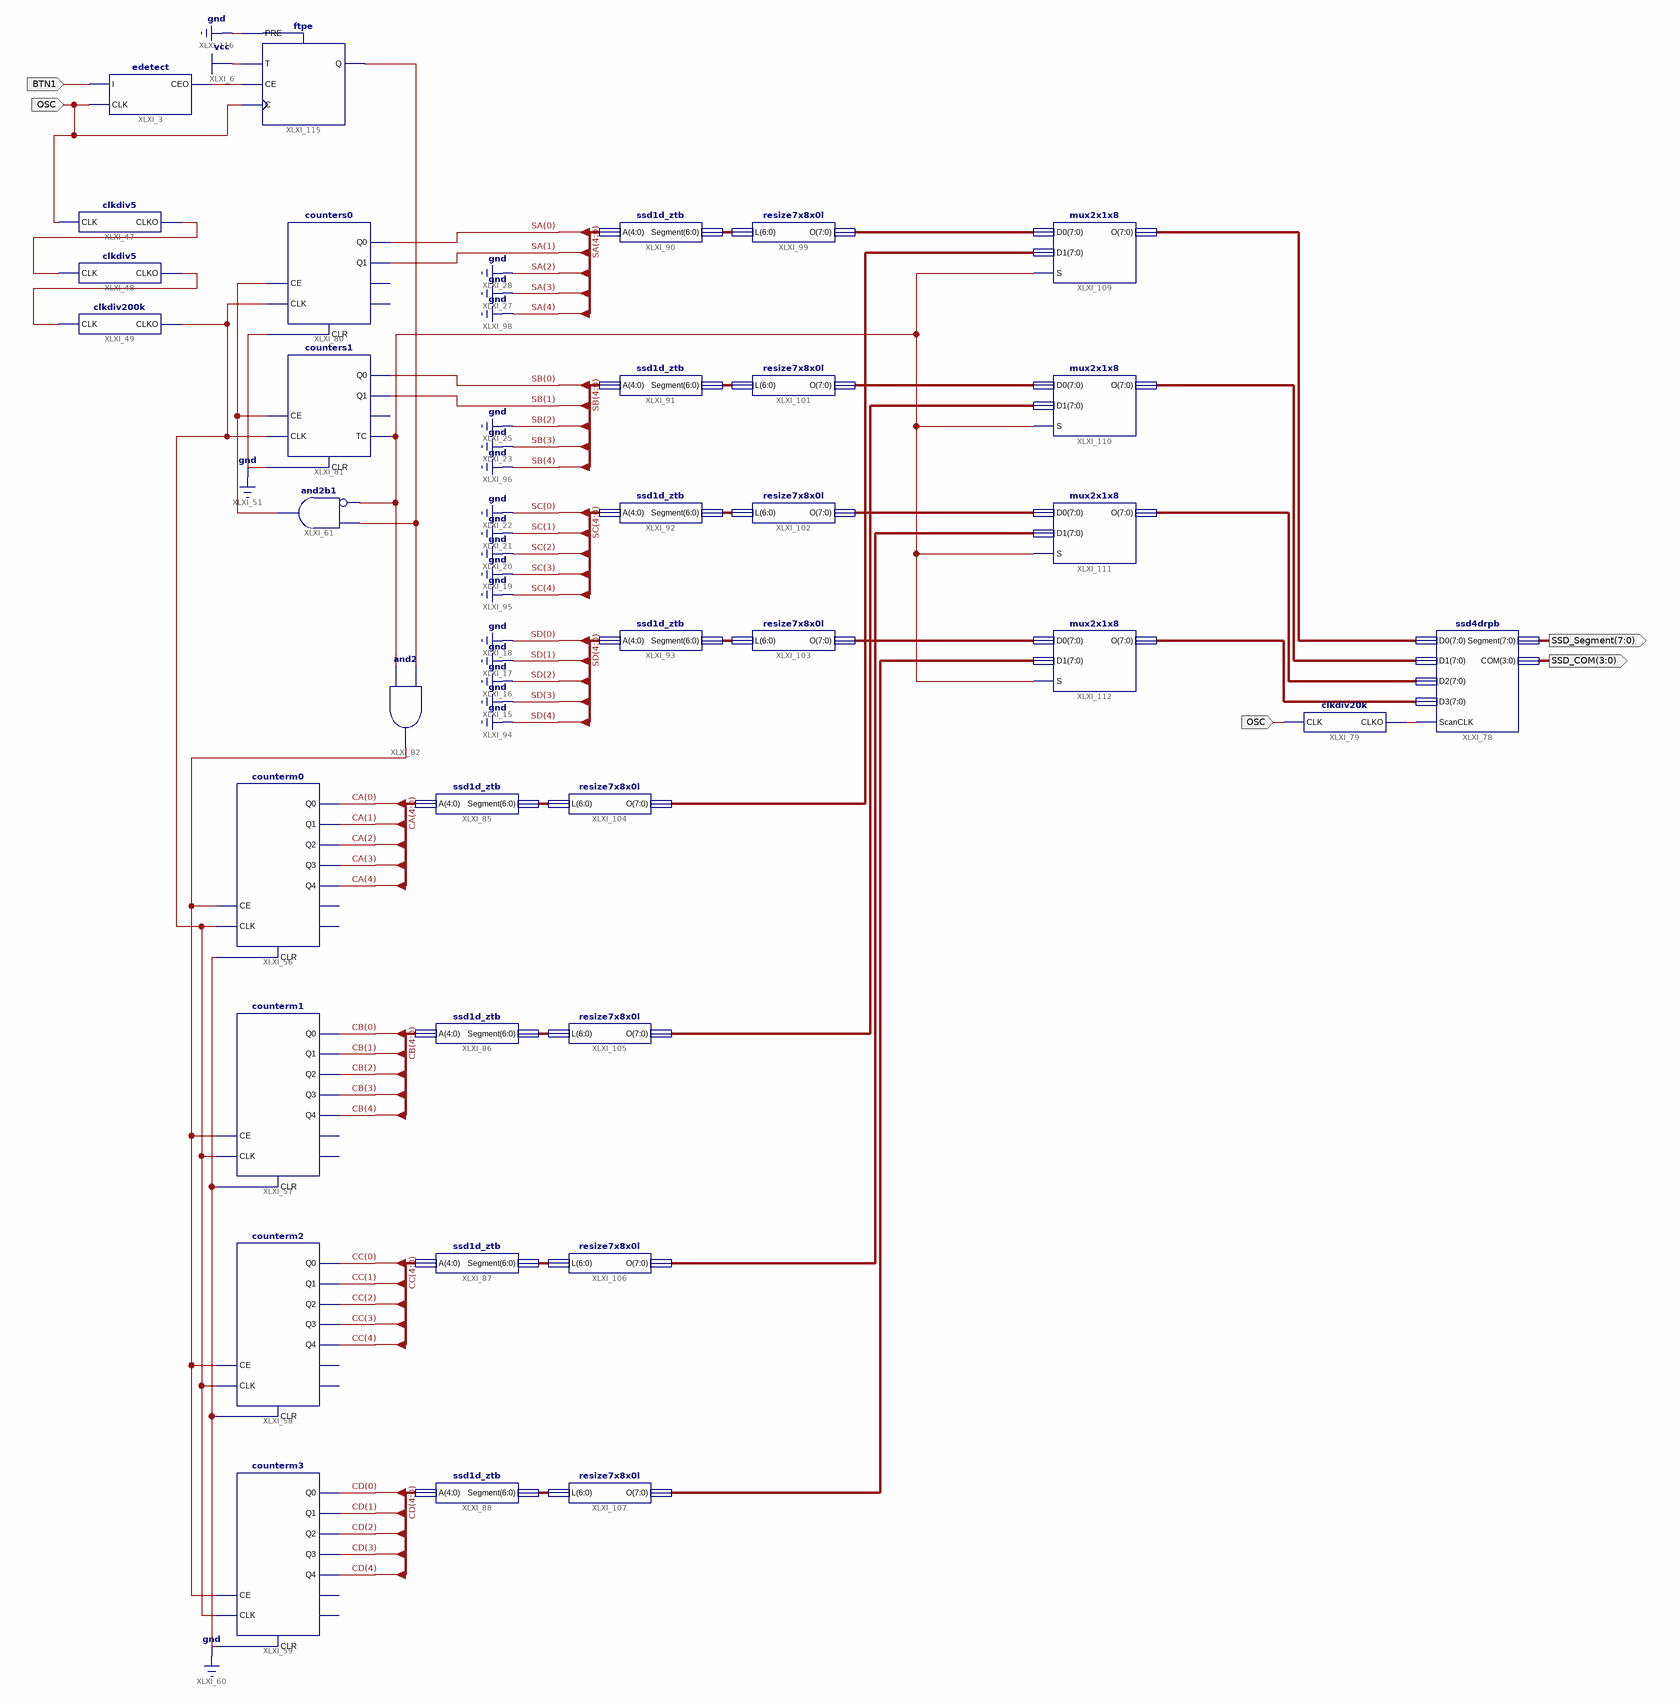
[diagram p0: schematic sheet 1]
// Xilinx ISE schematic main.sch (spartan6) as structural Verilog: 35 symbols, 4 ports
module main (
  input  BTN1,
  input  OSC,
  output [3:0] SSD_COM,
  output [7:0] SSD_Segment
);

  wire XLXN_1, XLXN_38, XLXN_39, XLXN_44, XLXN_48, XLXN_73, XLXN_113, XLXN_121, XLXN_222;
  wire [1:0] SA, SB;
  wire [4:0] CA, CB, CC, CD;
  wire [6:0] XLXN_173, XLXN_174, XLXN_175, XLXN_176, XLXN_177, XLXN_178, XLXN_179, XLXN_180;
  wire [7:0] XLXN_196, XLXN_197, XLXN_198, XLXN_199, XLXN_200, XLXN_201, XLXN_202, XLXN_203, XLXN_213,
       XLXN_215, XLXN_216, XLXN_217;

  edetect XLXI_3 (.CEO(XLXN_1), .CLK(OSC), .I(BTN1));
  clkdiv5 XLXI_47 (.CLK(OSC), .CLKO(XLXN_38));
  clkdiv5 XLXI_48 (.CLK(XLXN_38), .CLKO(XLXN_39));
  clkdiv200k XLXI_49 (.CLK(XLXN_39), .CLKO(XLXN_48));
  counterm0 XLXI_56 (
    .CE(XLXN_121), .CLK(XLXN_48), .CLR(1'b0), .Q0(CA[0]), .Q1(CA[1]), .Q2(CA[2]), .Q3(CA[3]), .Q4(CA[4]));  // open: CEO, TC
  counterm1 XLXI_57 (
    .CE(XLXN_121), .CLK(XLXN_48), .CLR(1'b0), .Q0(CB[0]), .Q1(CB[1]), .Q2(CB[2]), .Q3(CB[3]), .Q4(CB[4]));  // open: CEO, TC
  counterm2 XLXI_58 (
    .CE(XLXN_121), .CLK(XLXN_48), .CLR(1'b0), .Q0(CC[0]), .Q1(CC[1]), .Q2(CC[2]), .Q3(CC[3]), .Q4(CC[4]));  // open: CEO, TC
  counterm3 XLXI_59 (
    .CE(XLXN_121), .CLK(XLXN_48), .CLR(1'b0), .Q0(CD[0]), .Q1(CD[1]), .Q2(CD[2]), .Q3(CD[3]), .Q4(CD[4]));  // open: CEO, TC
  and XLXI_61 (XLXN_44, ~XLXN_222, XLXN_73);  // and2b1
  counters0 XLXI_80 (.CE(XLXN_44), .CLK(XLXN_48), .CLR(1'b0), .Q0(SA[0]), .Q1(SA[1]));  // open: CEO, TC
  counters1 XLXI_81 (.CE(XLXN_44), .CLK(XLXN_48), .CLR(1'b0), .Q0(SB[0]), .Q1(SB[1]), .TC(XLXN_222));  // open: CEO
  ssd1d_ztb XLXI_85 (.A(CA), .Segment(XLXN_177));
  ssd1d_ztb XLXI_86 (.A(CB), .Segment(XLXN_178));
  ssd1d_ztb XLXI_87 (.A(CC), .Segment(XLXN_179));
  ssd1d_ztb XLXI_88 (.A(CD), .Segment(XLXN_180));
  ssd1d_ztb XLXI_90 (.A({3'b000, SA}), .Segment(XLXN_173));
  ssd1d_ztb XLXI_91 (.A({3'b000, SB}), .Segment(XLXN_174));
  ssd1d_ztb XLXI_92 (.A({5{1'b0}}), .Segment(XLXN_175));
  ssd1d_ztb XLXI_93 (.A({5{1'b0}}), .Segment(XLXN_176));
  resize7x8x0l XLXI_99 (.L(XLXN_173), .O(XLXN_199));
  resize7x8x0l XLXI_101 (.L(XLXN_174), .O(XLXN_198));
  resize7x8x0l XLXI_102 (.L(XLXN_175), .O(XLXN_197));
  resize7x8x0l XLXI_103 (.L(XLXN_176), .O(XLXN_196));
  resize7x8x0l XLXI_104 (.L(XLXN_177), .O(XLXN_200));
  resize7x8x0l XLXI_105 (.L(XLXN_178), .O(XLXN_201));
  resize7x8x0l XLXI_106 (.L(XLXN_179), .O(XLXN_202));
  resize7x8x0l XLXI_107 (.L(XLXN_180), .O(XLXN_203));
  mux2x1x8 XLXI_109 (.D0(XLXN_199), .D1(XLXN_200), .O(XLXN_217), .S(XLXN_222));
  mux2x1x8 XLXI_110 (.D0(XLXN_198), .D1(XLXN_201), .O(XLXN_216), .S(XLXN_222));
  mux2x1x8 XLXI_111 (.D0(XLXN_197), .D1(XLXN_202), .O(XLXN_215), .S(XLXN_222));
  mux2x1x8 XLXI_112 (.D0(XLXN_196), .D1(XLXN_203), .O(XLXN_213), .S(XLXN_222));
  ssd4drpb XLXI_78 (
    .COM(SSD_COM), .D0(XLXN_217), .D1(XLXN_216), .D2(XLXN_215), .D3(XLXN_213), .ScanCLK(XLXN_113),
    .Segment(SSD_Segment));
  clkdiv20k XLXI_79 (.CLK(OSC), .CLKO(XLXN_113));
  and XLXI_82 (XLXN_121, XLXN_222, XLXN_73);
  ftpe XLXI_115 (.C(OSC), .CE(XLXN_1), .PRE(1'b0), .T(1'b1), .Q(XLXN_73));
endmodule
